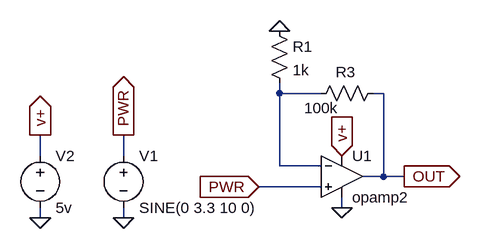
[diagram p0: schematic gain_amplification.asc]
gain_amplification.asc, the LTspice schematic file:
Version 4.1
SHEET 1 880 680
WIRE 64 48 64 32
WIRE 128 48 64 48
WIRE 224 48 208 48
WIRE -304 144 -304 112
WIRE -176 144 -176 112
WIRE 64 160 64 48
WIRE 128 160 64 160
WIRE 224 176 224 48
WIRE 224 176 192 176
WIRE 256 176 224 176
WIRE 128 192 32 192
WIRE 160 224 160 208
WIRE -304 240 -304 224
WIRE -176 240 -176 224
FLAG -176 112 PWR
IOPIN -176 112 Out
FLAG -176 240 0
FLAG 160 224 0
FLAG 64 -48 0
FLAG 256 176 OUT
IOPIN 256 176 Out
FLAG -304 240 0
FLAG -304 112 v+
IOPIN -304 112 Out
FLAG 160 144 v+
IOPIN 160 144 In
FLAG 32 192 PWR
IOPIN 32 192 In
SYMBOL OpAmps\\opamp2 160 112 R0
SYMATTR InstName U1
SYMBOL voltage -176 128 R0
WINDOW 123 0 0 Left 0
WINDOW 39 0 0 Left 0
SYMATTR InstName V1
SYMATTR Value SINE(0 3.3 10 0)
SYMBOL res 48 -64 R0
SYMATTR InstName R1
SYMATTR Value 1k
SYMBOL res 224 32 R90
WINDOW 0 -1 58 VBottom 2
WINDOW 3 23 96 VTop 2
SYMATTR InstName R3
SYMATTR Value 100k
SYMBOL voltage -304 128 R0
WINDOW 123 0 0 Left 0
WINDOW 39 0 0 Left 0
SYMATTR InstName V2
SYMATTR Value 5v

The netlist it stands for:
* gain_amplification.asc
X§U1 PWR N001 v+ 0 OUT opamp2  ; pins In+ In- V+ V- OUT
V1 PWR 0 SINE(0 3.3 10 0)
R1 0 N001 1k
R3 OUT N001 100k
V2 v+ 0 5v
.backanno
.end